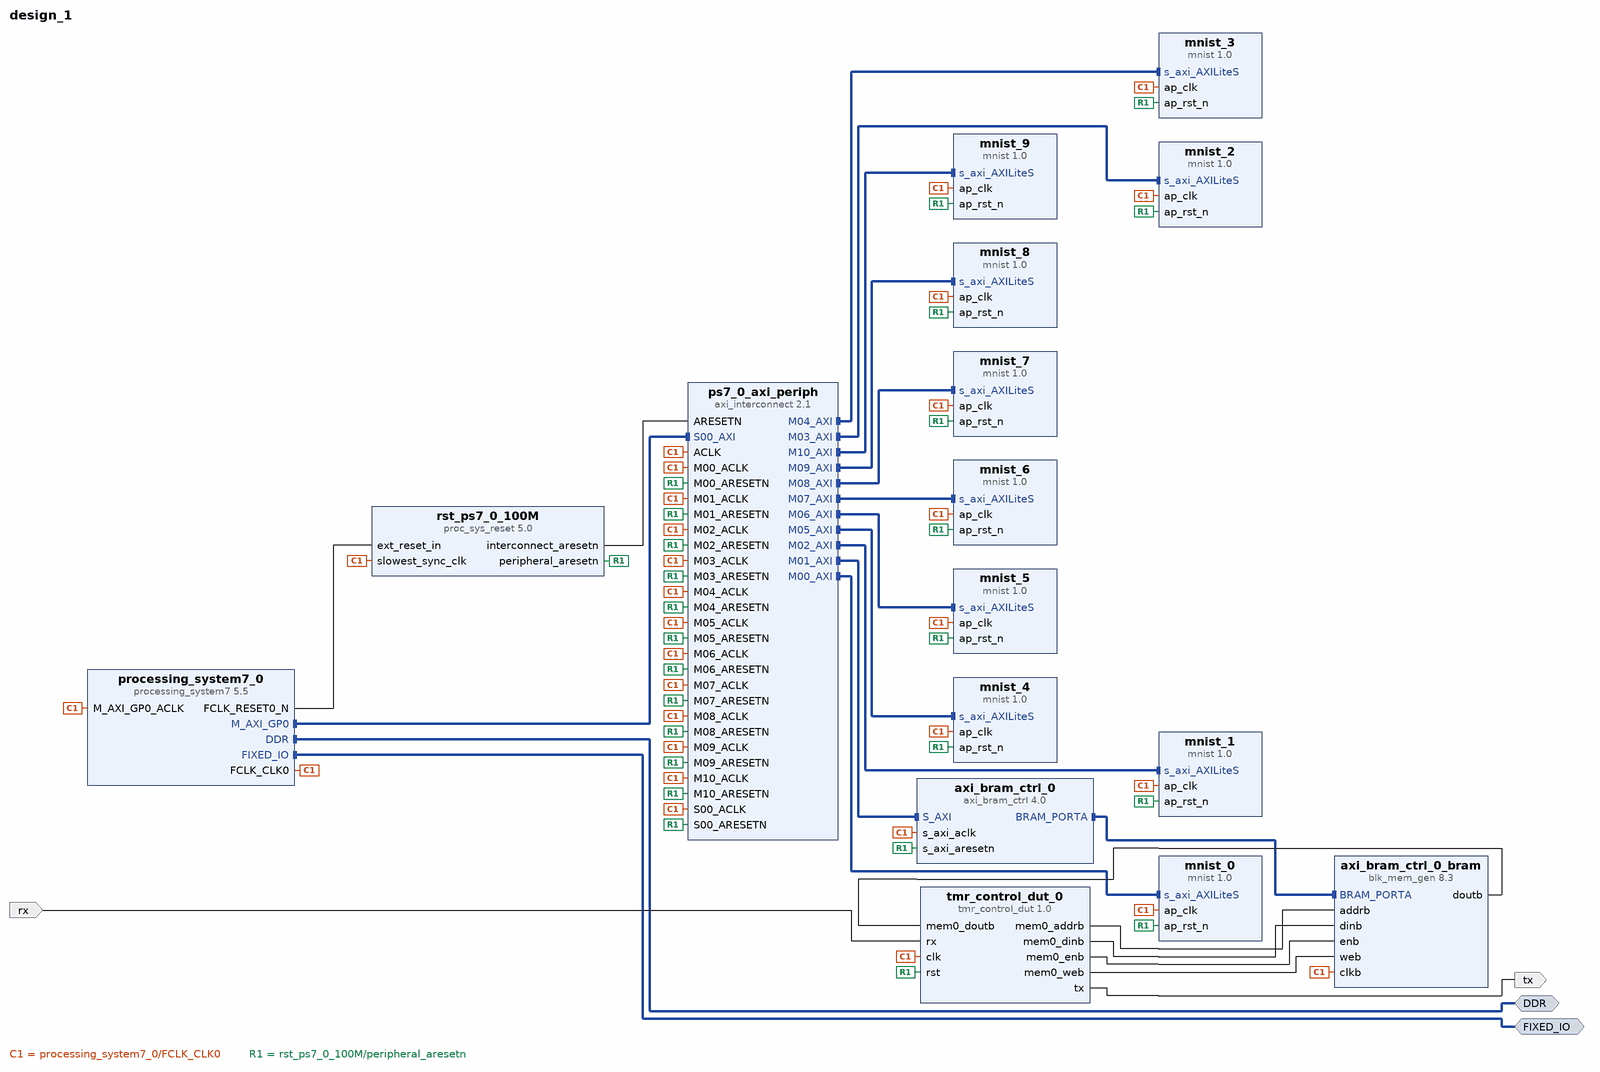
[diagram p0: block diagram of the top level]
# Vivado block design design_1, xc7z020clg484-1, Vivado 2016.4
create_bd_design design_1

create_bd_intf_port -mode Master -vlnv xilinx.com:interface:ddrx_rtl:1.0 DDR
create_bd_intf_port -mode Master -vlnv xilinx.com:display_processing_system7:fixedio_rtl:1.0 FIXED_IO
create_bd_port -dir O tx
create_bd_port -dir I rx

create_bd_cell -type ip -vlnv xilinx.com:ip:processing_system7:5.5 processing_system7_0
set_property -dict {CONFIG.preset ZedBoard} [get_bd_cells processing_system7_0]
create_bd_cell -type ip -vlnv xilinx.com:hls:mnist:1.0 mnist_0
create_bd_cell -type ip -vlnv xilinx.com:ip:axi_interconnect:2.1 ps7_0_axi_periph
set_property -dict {CONFIG.NUM_MI 11} [get_bd_cells ps7_0_axi_periph]
create_bd_cell -type ip -vlnv xilinx.com:ip:proc_sys_reset:5.0 rst_ps7_0_100M
create_bd_cell -type ip -vlnv xilinx.com:ip:axi_bram_ctrl:4.0 axi_bram_ctrl_0
set_property -dict {CONFIG.PROTOCOL AXI4LITE CONFIG.SINGLE_PORT_BRAM 1 CONFIG.USE_ECC 0} [get_bd_cells axi_bram_ctrl_0]
create_bd_cell -type ip -vlnv xilinx.com:ip:blk_mem_gen:8.3 axi_bram_ctrl_0_bram
set_property -dict [list \
  CONFIG.Memory_Type True_Dual_Port_RAM \
  CONFIG.Assume_Synchronous_Clk false \
  CONFIG.Enable_B Use_ENB_Pin \
  CONFIG.Use_RSTB_Pin true \
  CONFIG.Port_B_Clock 100 \
  CONFIG.Port_B_Write_Rate 50 \
  CONFIG.Port_B_Enable_Rate 100 \
] [get_bd_cells axi_bram_ctrl_0_bram]
create_bd_cell -type ip -vlnv xilinx.com:hls:mnist:1.0 mnist_1
create_bd_cell -type ip -vlnv xilinx.com:hls:mnist:1.0 mnist_2
create_bd_cell -type ip -vlnv xilinx.com:hls:mnist:1.0 mnist_3
create_bd_cell -type ip -vlnv xilinx.com:hls:mnist:1.0 mnist_4
create_bd_cell -type ip -vlnv xilinx.com:user:tmr_control_dut:1.0 tmr_control_dut_0
set_property -dict {CONFIG.BYTES_TO_UART 44} [get_bd_cells tmr_control_dut_0]
create_bd_cell -type ip -vlnv xilinx.com:hls:mnist:1.0 mnist_5
create_bd_cell -type ip -vlnv xilinx.com:hls:mnist:1.0 mnist_6
create_bd_cell -type ip -vlnv xilinx.com:hls:mnist:1.0 mnist_7
create_bd_cell -type ip -vlnv xilinx.com:hls:mnist:1.0 mnist_8
create_bd_cell -type ip -vlnv xilinx.com:hls:mnist:1.0 mnist_9

# ---- connections ----

connect_bd_intf_net [get_bd_intf_pins processing_system7_0/M_AXI_GP0] [get_bd_intf_pins ps7_0_axi_periph/S00_AXI]
connect_bd_intf_net [get_bd_intf_pins ps7_0_axi_periph/M00_AXI] [get_bd_intf_pins mnist_0/s_axi_AXILiteS]
connect_bd_intf_net [get_bd_intf_pins ps7_0_axi_periph/M01_AXI] [get_bd_intf_pins axi_bram_ctrl_0/S_AXI]
connect_bd_intf_net [get_bd_intf_pins axi_bram_ctrl_0_bram/BRAM_PORTA] [get_bd_intf_pins axi_bram_ctrl_0/BRAM_PORTA]
connect_bd_intf_net [get_bd_intf_pins ps7_0_axi_periph/M02_AXI] [get_bd_intf_pins mnist_1/s_axi_AXILiteS]
connect_bd_intf_net [get_bd_intf_pins ps7_0_axi_periph/M03_AXI] [get_bd_intf_pins mnist_2/s_axi_AXILiteS]
connect_bd_intf_net [get_bd_intf_pins ps7_0_axi_periph/M04_AXI] [get_bd_intf_pins mnist_3/s_axi_AXILiteS]
connect_bd_intf_net [get_bd_intf_pins ps7_0_axi_periph/M05_AXI] [get_bd_intf_pins mnist_4/s_axi_AXILiteS]
connect_bd_intf_net [get_bd_intf_pins ps7_0_axi_periph/M06_AXI] [get_bd_intf_pins mnist_5/s_axi_AXILiteS]
connect_bd_intf_net [get_bd_intf_pins ps7_0_axi_periph/M07_AXI] [get_bd_intf_pins mnist_6/s_axi_AXILiteS]
connect_bd_intf_net [get_bd_intf_pins ps7_0_axi_periph/M08_AXI] [get_bd_intf_pins mnist_7/s_axi_AXILiteS]
connect_bd_intf_net [get_bd_intf_pins ps7_0_axi_periph/M09_AXI] [get_bd_intf_pins mnist_8/s_axi_AXILiteS]
connect_bd_intf_net [get_bd_intf_pins ps7_0_axi_periph/M10_AXI] [get_bd_intf_pins mnist_9/s_axi_AXILiteS]
connect_bd_intf_net [get_bd_intf_ports DDR] [get_bd_intf_pins processing_system7_0/DDR]
connect_bd_intf_net [get_bd_intf_ports FIXED_IO] [get_bd_intf_pins processing_system7_0/FIXED_IO]
connect_bd_net [get_bd_pins processing_system7_0/FCLK_CLK0] \
  [get_bd_pins processing_system7_0/M_AXI_GP0_ACLK] [get_bd_pins rst_ps7_0_100M/slowest_sync_clk] \
  [get_bd_pins mnist_0/ap_clk] [get_bd_pins axi_bram_ctrl_0/s_axi_aclk] [get_bd_pins axi_bram_ctrl_0_bram/clkb] \
  [get_bd_pins ps7_0_axi_periph/S00_ACLK] [get_bd_pins ps7_0_axi_periph/ACLK] [get_bd_pins ps7_0_axi_periph/M00_ACLK] \
  [get_bd_pins ps7_0_axi_periph/M01_ACLK] [get_bd_pins mnist_1/ap_clk] [get_bd_pins ps7_0_axi_periph/M02_ACLK] \
  [get_bd_pins mnist_2/ap_clk] [get_bd_pins ps7_0_axi_periph/M03_ACLK] [get_bd_pins mnist_3/ap_clk] \
  [get_bd_pins ps7_0_axi_periph/M04_ACLK] [get_bd_pins mnist_4/ap_clk] [get_bd_pins ps7_0_axi_periph/M05_ACLK] \
  [get_bd_pins tmr_control_dut_0/clk] [get_bd_pins mnist_5/ap_clk] [get_bd_pins ps7_0_axi_periph/M06_ACLK] \
  [get_bd_pins mnist_6/ap_clk] [get_bd_pins ps7_0_axi_periph/M07_ACLK] [get_bd_pins mnist_7/ap_clk] \
  [get_bd_pins ps7_0_axi_periph/M08_ACLK] [get_bd_pins mnist_8/ap_clk] [get_bd_pins ps7_0_axi_periph/M09_ACLK] \
  [get_bd_pins mnist_9/ap_clk] [get_bd_pins ps7_0_axi_periph/M10_ACLK]
connect_bd_net [get_bd_pins processing_system7_0/FCLK_RESET0_N] [get_bd_pins rst_ps7_0_100M/ext_reset_in]
connect_bd_net [get_bd_pins rst_ps7_0_100M/peripheral_aresetn] \
  [get_bd_pins mnist_0/ap_rst_n] [get_bd_pins axi_bram_ctrl_0/s_axi_aresetn] [get_bd_pins ps7_0_axi_periph/S00_ARESETN] \
  [get_bd_pins ps7_0_axi_periph/M00_ARESETN] [get_bd_pins ps7_0_axi_periph/M01_ARESETN] [get_bd_pins mnist_1/ap_rst_n] \
  [get_bd_pins ps7_0_axi_periph/M02_ARESETN] [get_bd_pins mnist_2/ap_rst_n] [get_bd_pins ps7_0_axi_periph/M03_ARESETN] \
  [get_bd_pins mnist_3/ap_rst_n] [get_bd_pins ps7_0_axi_periph/M04_ARESETN] [get_bd_pins mnist_4/ap_rst_n] \
  [get_bd_pins ps7_0_axi_periph/M05_ARESETN] [get_bd_pins tmr_control_dut_0/rst] [get_bd_pins mnist_5/ap_rst_n] \
  [get_bd_pins ps7_0_axi_periph/M06_ARESETN] [get_bd_pins mnist_6/ap_rst_n] [get_bd_pins ps7_0_axi_periph/M07_ARESETN] \
  [get_bd_pins mnist_7/ap_rst_n] [get_bd_pins ps7_0_axi_periph/M08_ARESETN] [get_bd_pins mnist_8/ap_rst_n] \
  [get_bd_pins ps7_0_axi_periph/M09_ARESETN] [get_bd_pins mnist_9/ap_rst_n] [get_bd_pins ps7_0_axi_periph/M10_ARESETN]
connect_bd_net [get_bd_pins rst_ps7_0_100M/interconnect_aresetn] [get_bd_pins ps7_0_axi_periph/ARESETN]
connect_bd_net [get_bd_pins tmr_control_dut_0/tx] [get_bd_ports tx]
connect_bd_net [get_bd_ports rx] [get_bd_pins tmr_control_dut_0/rx]
connect_bd_net [get_bd_pins tmr_control_dut_0/mem0_addrb] [get_bd_pins axi_bram_ctrl_0_bram/addrb]
connect_bd_net [get_bd_pins axi_bram_ctrl_0_bram/doutb] [get_bd_pins tmr_control_dut_0/mem0_doutb]
connect_bd_net [get_bd_pins tmr_control_dut_0/mem0_dinb] [get_bd_pins axi_bram_ctrl_0_bram/dinb]
connect_bd_net [get_bd_pins tmr_control_dut_0/mem0_enb] [get_bd_pins axi_bram_ctrl_0_bram/enb]
connect_bd_net [get_bd_pins tmr_control_dut_0/mem0_web] [get_bd_pins axi_bram_ctrl_0_bram/web]

# ---- address map ----
assign_bd_address -offset 0x40000000 -range 8K -target_address_space [get_bd_addr_spaces processing_system7_0/Data] [get_bd_addr_segs axi_bram_ctrl_0/S_AXI/Mem0]
assign_bd_address -offset 0x43C00000 -range 64K -target_address_space [get_bd_addr_spaces processing_system7_0/Data] [get_bd_addr_segs mnist_0/s_axi_AXILiteS/Reg]
assign_bd_address -offset 0x43C10000 -range 64K -target_address_space [get_bd_addr_spaces processing_system7_0/Data] [get_bd_addr_segs mnist_1/s_axi_AXILiteS/Reg]
assign_bd_address -offset 0x43C20000 -range 64K -target_address_space [get_bd_addr_spaces processing_system7_0/Data] [get_bd_addr_segs mnist_2/s_axi_AXILiteS/Reg]
assign_bd_address -offset 0x43C30000 -range 64K -target_address_space [get_bd_addr_spaces processing_system7_0/Data] [get_bd_addr_segs mnist_3/s_axi_AXILiteS/Reg]
assign_bd_address -offset 0x43C40000 -range 64K -target_address_space [get_bd_addr_spaces processing_system7_0/Data] [get_bd_addr_segs mnist_4/s_axi_AXILiteS/Reg]
assign_bd_address -offset 0x43C50000 -range 64K -target_address_space [get_bd_addr_spaces processing_system7_0/Data] [get_bd_addr_segs mnist_5/s_axi_AXILiteS/Reg]
assign_bd_address -offset 0x43C60000 -range 64K -target_address_space [get_bd_addr_spaces processing_system7_0/Data] [get_bd_addr_segs mnist_6/s_axi_AXILiteS/Reg]
assign_bd_address -offset 0x43C70000 -range 64K -target_address_space [get_bd_addr_spaces processing_system7_0/Data] [get_bd_addr_segs mnist_7/s_axi_AXILiteS/Reg]
assign_bd_address -offset 0x43C80000 -range 64K -target_address_space [get_bd_addr_spaces processing_system7_0/Data] [get_bd_addr_segs mnist_8/s_axi_AXILiteS/Reg]
assign_bd_address -offset 0x43C90000 -range 64K -target_address_space [get_bd_addr_spaces processing_system7_0/Data] [get_bd_addr_segs mnist_9/s_axi_AXILiteS/Reg]

validate_bd_design
save_bd_design
